# Altium schematic sheet Liquid Tube.SchDoc: Liquid Tube
size A3; Date: January 2022; Author: Mateusz Kowalczyk; DrawnBy: Mateusz Kowalczyk; Engineer: Mateusz Kowalczyk; Organization: Guitar Effect; Address1: Liquid Series; Address2: Enclosure 1590BB; Address3: Drive; Address4: Analog; DocumentNumber: 1; Revision: 2; SheetNumber: 1; SheetTotal: 1
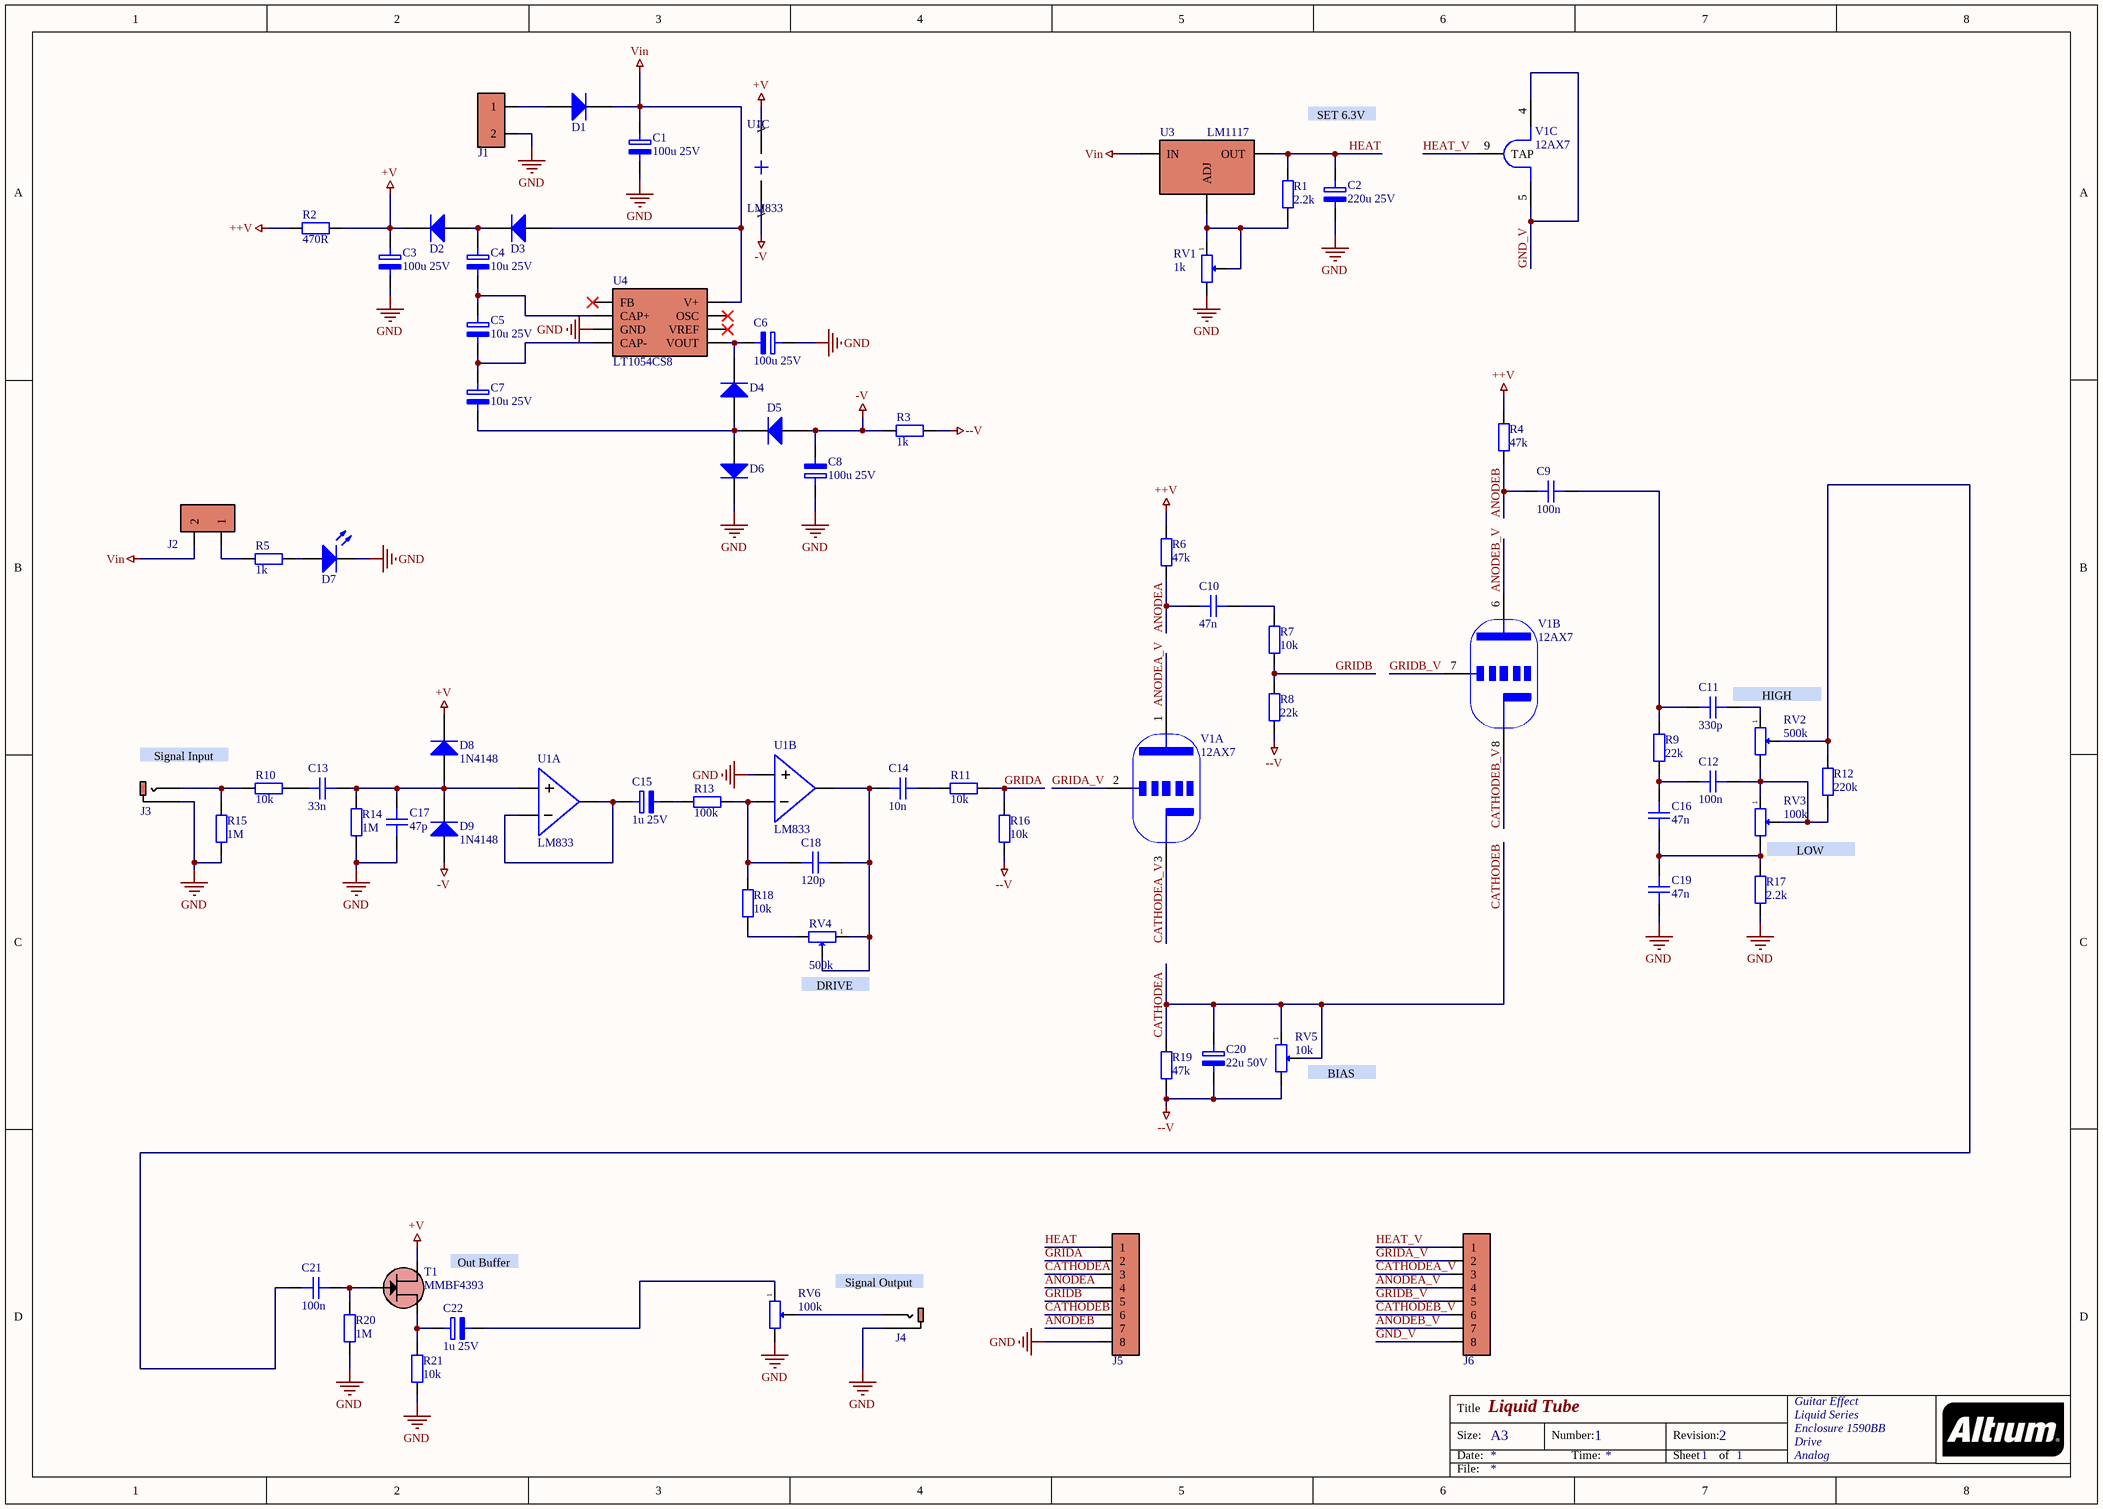
[diagram p0: Liquid Tube.SchDoc]

## Parts
C1  100u 25V  [CAPACITOR THT 6.3X11MM]
C2  220u 25V  [CAPACITOR THT 6.3X11MM]
C3  100u 25V  [CAPACITOR THT 6.3X11MM]
C4  10u 25V  [CAPACITOR THT 5X11MM]
C5  10u 25V  [CAPACITOR THT 5X11MM]
C6  100u 25V  [CAPACITOR THT 6.3X11MM]
C7  10u 25V  [CAPACITOR THT 5X11MM]
C8  100u 25V  [CAPACITOR THT 6.3X11MM]
C9  100n  [CAPACITOR 7.2X2.5MM LS=5MM MKT]
C10  47n  [CAPACITOR 7.2X2.5MM LS=5MM MKT]
C11  330p  [Capacitor 0603]
C12  100n  [CAPACITOR 7.2X2.5MM LS=5MM MKT]
C13  33n  [CAPACITOR 7.2X2.5MM LS=5MM MKT]
C14  10n  [CAPACITOR 7.2X2.5MM LS=5MM MKT]
C15  1u 25V  [CAPACITOR THT 5X11MM]
C16  47n  [CAPACITOR 7.2X2.5MM LS=5MM MKT]
C17  47p  [Capacitor 0603]
C18  120p  [Capacitor 0603]
C19  47n  [CAPACITOR 7.2X2.5MM LS=5MM MKT]
C20  22u 50V  [CAPACITOR THT 5X11MM]
C21  100n  [CAPACITOR 7.2X2.5MM LS=5MM MKT]
C22  1u 25V  [CAPACITOR THT 5X11MM]
D1  S1M-13-F  [DO-214]  (value not drawn)
D2  S1M-13-F  [DO-214]  (value not drawn)
D3  S1M-13-F  [DO-214]  (value not drawn)
D4  S1M-13-F  [DO-214]  (value not drawn)
D5  S1M-13-F  [DO-214]  (value not drawn)
D6  S1M-13-F  [DO-214]  (value not drawn)
D7  Diode LED 5mm  [LED 5MM THT]  (value not drawn)
D8  1N4148  [SOD80]
D9  1N4148  [SOD80]
J1  Mechanical Goldpin 1x2 THT 2.54mm  [GOLDPIN 1X2]  (value not drawn)
J2  Mechanical Goldpin 1x2 THT 2.54mm  [GOLDPIN 1X2]  (value not drawn)
J3  ACJM-MVS  [MECHANICAL JACK MONO ACJM-MVS]  (value not drawn)
J4  ACJM-MVS  [MECHANICAL JACK MONO ACJM-MVS]  (value not drawn)
J5  Mechanical Goldpin 1x8 THT 2.54mm  [GOLDPIN 1X8]  (value not drawn)
J6  Mechanical Goldpin 1x8 THT 2.54mm  [GOLDPIN 1X8]  (value not drawn)
R1  2.2k  [Resistor 0603]
R2  470R  [Resistor 0603]
R3  1k  [Resistor 0603]
R4  47k  [Resistor 0603]
R5  1k  [Resistor 0603]
R6  47k  [Resistor 0603]
R7  10k  [Resistor 0603]
R8  22k  [Resistor 0603]
R9  22k  [Resistor 0603]
R10  10k  [Resistor 0603]
R11  10k  [Resistor 0603]
R12  220k  [Resistor 0603]
R13  100k  [Resistor 0603]
R14  1M  [Resistor 0603]
R15  1M  [Resistor 0603]
R16  10k  [Resistor 0603]
R17  2.2k  [Resistor 0603]
R18  10k  [Resistor 0603]
R19  47k  [Resistor 0603]
R20  1M  [Resistor 0603]
R21  10k  [Resistor 0603]
RV1  1k  [POTENTIOMETER 1.2X3.8MM]
RV2  500k  [POTENTIOMETER 9x11mm ALPS-RK097 THT]
RV3  100k  [POTENTIOMETER 9x11mm ALPS-RK097 THT]
RV4  500k  [POTENTIOMETER 9x11mm ALPS-RK097 THT]
RV5  10k  [POTENTIOMETER 9x11mm ALPS-RK097 THT]
RV6  100k  [POTENTIOMETER 9x11mm ALPS-RK097 THT]
T1  MMBF4393  [SOT23-3]
U1  LM833  [SO8]  (parts A,B,C of 3)
U3  LM1117  [TO252]
U4  LT1054CS8  [SO8]
V1  12AX7  [TUbe 9pin NOVAL]  (parts A,B,C of 3)

## Nets
++V: R2.1 R4.2 R6.2
+V: C3.1 D2.2 D8.2 R2.2 T1.1(D) U1.8(V+)
--V: C20.2 R3.2 R8.1 R16.2 R19.1 RV5.3
-V: C8.2 D5.1 D9.1 R3.1 U1.4(V-)
GND: C1.2 C2.2 C3.2 C6.1 C8.1 C17.1 C19.1 D6.2 D7.2 J1.2 J3.2 J4.2 J5.8 R14.1 R15.1 R17.1 R20.1 R21.1 RV1.3 RV6.3 U1.5(IN+) U4.3(GND)
Vin: C1.1 D1.2 D3.1 J2.2 U3.3(IN) U4.8(V+)
ANODEA: C10.1 J5.4 R6.1
ANODEA_V: J6.4 V1.1(PLATE2)
ANODEB: C9.1 J5.7 R4.1
ANODEB_V: J6.7 V1.6(PLATE1)
CATHODEA: C20.1 J5.3 J5.6 R19.2 RV5.1 RV5.2  [also labelled CATHODEB]
CATHODEA_V: J6.3 V1.3(CATHODE2)
CATHODEB_V: J6.6 V1.8(CATHODE1)
GND_V: J6.8 V1.4(FIL1) V1.5(FIL2)
GRIDA: J5.2 R11.1 R16.1
GRIDA_V: J6.2 V1.2(GRID2)
GRIDB: J5.5 R7.1 R8.2
GRIDB_V: J6.5 V1.7(GRID1)
HEAT: C2.1 J5.1 R1.2 U3.2(OUT)
HEAT_V: J6.1 V1.9(TAP)
NetC4_1: C4.1 D2.1 D3.2
NetC4_2: C4.2 C5.1 U4.2(CAP+)
NetC5_2: C5.2 C7.1 U4.4(CAP-)
NetC6_2: C6.2 D4.2 U4.5(VOUT)
NetC7_2: C7.2 D4.1 D5.2 D6.1
NetC9_2: C9.2 C11.1 R9.2
NetC10_2: C10.2 R7.2
NetC11_2: C11.2 RV2.1
NetC12_1: C12.1 C16.2 R9.1
NetC12_2: C12.2 R12.1 RV2.3 RV3.1 RV3.2
NetC13_1: C13.1 R10.2
NetC13_2: C13.2 C17.2 D8.1 D9.2 R14.2 U1.3(IN+)
NetC14_1: C14.1 C18.2 RV4.1 RV4.2 U1.7(OUT)
NetC14_2: C14.2 R11.2
NetC15_1: C15.1 U1.1(OUT) U1.2(IN-)
NetC15_2: C15.2 R13.1
NetC16_1: C16.1 C19.2 R17.2 RV3.3
NetC18_1: C18.1 R13.2 R18.2 U1.6(IN-)
NetC21_1: C21.1 R12.2 RV2.2
NetC21_2: C21.2 R20.2 T1.3(G)
NetC22_1: C22.1 R21.2 T1.2(S)
NetC22_2: C22.2 RV6.1
NetD1_1: D1.1 J1.1
NetD7_1: D7.1 R5.2
NetJ2_1: J2.1 R5.1
NetJ3_1: J3.1 R10.1 R15.2
NetJ4_1: J4.1 RV6.2
NetR1_1: R1.1 RV1.1 RV1.2 U3.1(ADJ)
NetR18_1: R18.1 RV4.3

Not connected (* = marked no-connect by the designer): U4 1(FB)* 6(VREF)* 7(OSC)*

## Notes on the sheet
- SET 6.3V
  DRIVE
- (near C11) HIGH
- Signal Input
- (near RV3) LOW
- (near RV4) DRIVE
- (near RV5) BIAS
- (near T1) Out Buffer
- (near J4) Signal Output
- Title
- Size:
- Date:
- A3
- Number:
- Time:
- Revision:
- Sheet
- of
- File:

## Library data of the parts
C1 C3 C6 C8 = Capacitor ALU THT 100u 25V
C2 = Capacitor ALU THT 220u 25V
C4 C5 C7 = Capacitor ALU THT 10u 25V
C9 C12 C21 = Capacitor MKT 100n 100V
C10 C16 C19 = Capacitor MKT 47n 100V
C11 = Capacitor 0603 330p
C13 = Capacitor MKT 33n 100V
C14 = Capacitor MKT 10n 100V
C15 C22 = Capacitor ALU THT 1u 25V
C17 = Capacitor 0603 47p
C18 = Capacitor 0603 120p
C20 = Capacitor ALU THT 22u 50V
D1-D6 = Diode 1KV 1A S1M-13-F
D8 D9 = Diode SMD 1N4148 SOD80
J3 J4 = Mechanical JACK Panel Mono Female Amphenol ACJM-MVS
R1 R17 = Resistor 0603 2.2k
R2 = Resistor 0603 470R
R3 R5 = Resistor 0603 1k
R4 R6 R19 = Resistor 0603 47k
R7 R10 R11 R16 R18 R21 = Resistor 0603 10k
R8 R9 = Resistor 0603 22k
R12 = Resistor 0603 220k
R13 = Resistor 0603 100k
R14 R15 R20 = Resistor 0603 1Meg
RV1 = Potentiometer SMD 1.2x3.8mm 1k
RV2 RV4 = Potentiometer 9x11mm Panel 500k MONO LIN ALPS-RK097
RV3 RV6 = Potentiometer 9x11mm Panel 100k MONO LIN ALPS-RK097
RV5 = Potentiometer 9x11mm Panel 10k MONO LIN ALPS-RK097
T1 = Transistor N-JFET SMD SOT23 MMBF4393
U1 = IC OP-AMP LM833 SO8: ComponentLink1Description: Datasheet; ComponentLink1URL: https://pl.mouser.com/datasheet/2/389/cd00000474-1795554.pdf
U3 = IC LM1117 LDO TO252 ADJ
U4 = IC 100mA Sw Cap SO8 LT1054CS8
V1 = Tube 12AX7 / ECC83 9pin NOVAL